# Altium schematic sheet SerialToUSB.SchDoc
size Letter; CompanyName: Penn Electric Racing; Organization: Penn Electric Racing; Address1: 220 S. 33rd St; Address2: Towne Bldg, B11; Address3: Philadelpia, PA 19104; Address4: USA; SheetNumber: 3; SheetTotal: 12
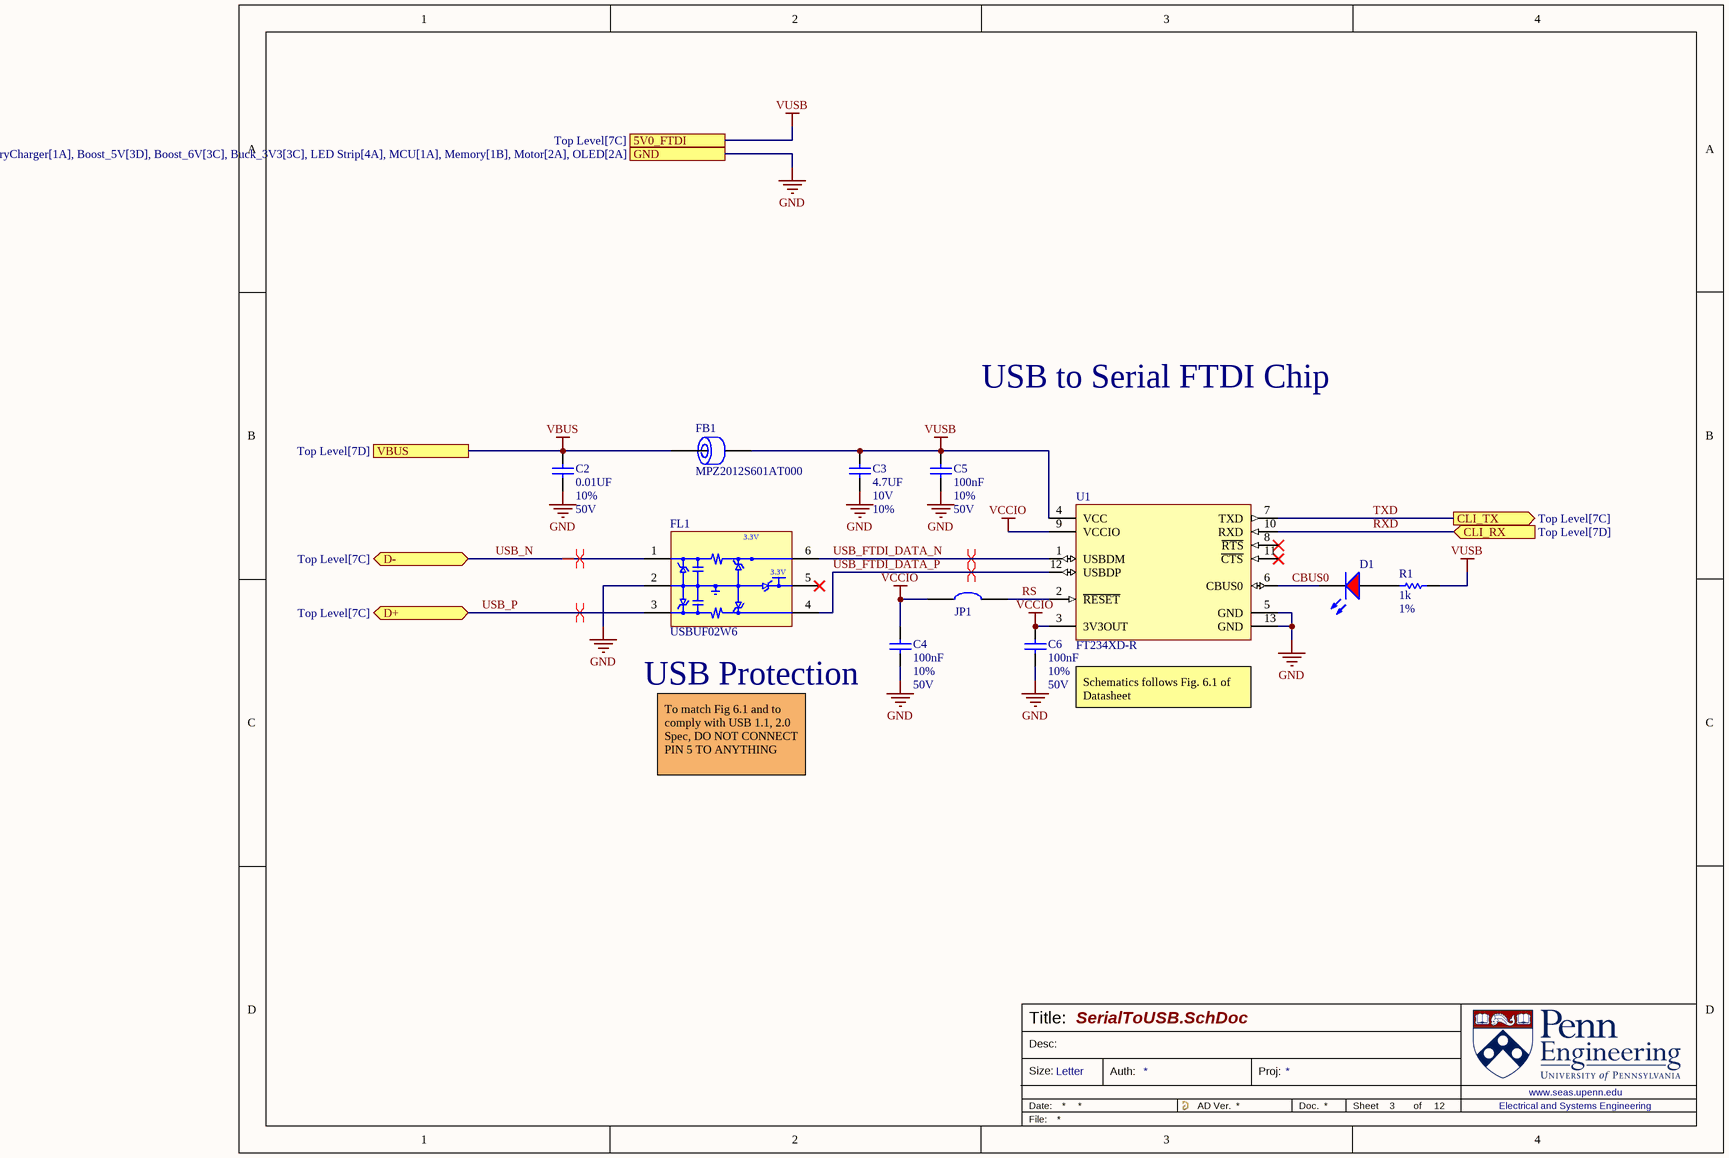
[diagram p0: SerialToUSB.SchDoc]

## Parts
C2  value 0.01UF  Tolerance: 10%  Voltage: 50V  [0603_CAP]  (hidden comment: CAP 0603 0.01UF 50V 10% X7R)
C3  value 4.7UF  Voltage: 10V  Tolerance: 10%  [0805_CAP]  (hidden comment: CAP 0805 4.7UF 10V 10% X7R)
C4  value 100nF  Tolerance: 10%  Voltage: 50V  [0603_CAP]  (hidden comment: CAP 0603 0.1UF 50V 10% X7R)
C5  value 100nF  Tolerance: 10%  Voltage: 50V  [0603_CAP]  (hidden comment: CAP 0603 0.1UF 50V 10% X7R)
C6  value 100nF  Tolerance: 10%  Voltage: 50V  [0603_CAP]  (hidden comment: CAP 0603 0.1UF 50V 10% X7R)
D1  LSM0805412V  [LED_0805_RED]  (value not drawn)
FB1  MPZ2012S601AT000  [FP-MPZ2012-MFG (0805)]
FL1  USBUF02W6  [SOT-363-6-ST]
JP1  0603 link  [0603_JP_RES]  (value not drawn)
R1  value 1k  Tolerance: 1%  [0603_RES]  (hidden comment: RES 0603 1K 1%)
U1  FT234XD-R  [FP-DFN-12-MFG]

## Ports
5V0_FTDI (see Top Level[7C]), CLI_RX (in, see Top Level[7D]), CLI_TX (out, see Top Level[7C]), D+ (bidir, see Top Level[7C]), D- (bidir, see Top Level[7C]), GND (see Top Level[7C], AI_Audio_Module[4A], BatteryCharger[1A], Boost_5V[3D], Boost_6V[3C], Buck_3V3[3C], LED Strip[4A], MCU[1A], Memory[1B], Motor[2A], OLED[2A]), VBUS (see Top Level[7D])

## Nets
GND: C2.1 C3.1 C4.1 C5.1 C6.1 FL1.2(GND) U1.5(GND) U1.13(GND) ; port GND
VBUS: C2.2 FB1.1 ; port VBUS
VCCIO: C4.2 C6.2 JP1.1 U1.3(3V3OUT) U1.9(VCCIO)
VUSB: C3.2 C5.2 FB1.2 R1.2 U1.4(VCC) ; port 5V0_FTDI
CBUS0: D1.K U1.6(CBUS0)
RS: JP1.2 U1.2(~{RESET})
RXD: U1.10(RXD) ; port CLI_RX
TXD: U1.7(TXD) ; port CLI_TX
USB_FTDI_DATA_N: FL1.6(D4) U1.1(USBDM)
USB_FTDI_DATA_P: FL1.4(D3) U1.12(USBDP)
USB_N: FL1.1(D1) ; port D-
USB_P: FL1.3(D2) ; port D+
NetD1_A: D1.A R1.1

Not connected (* = marked no-connect by the designer): FL1 5(3.3_V)*; U1 8(~{RTS})* 11(~{CTS})*

## Layout directives
differential pair; differential pair class USB; net class USB: USB_FTDI_DATA_N, USB_FTDI_DATA_P
differential pair: USB_N, USB_P

## Notes on the sheet
- USB to Serial FTDI Chip
- (near C4) USB Protection
- Schematics follows Fig. 6.1 of Datasheet
- To match Fig 6.1 and to comply with USB 1.1, 2.0 Spec, DO NOT CONNECT PIN 5 TO ANYTHING
- Title:
- Desc:
- Size:
- Letter
- Auth:
- Proj:
- Sheet
- of
- www.seas.upenn.edu
- Electrical and Systems Engineering

## Library data of the parts
C2 = CMP-011-000188-2: Capacitor Surface Mount 0603 Footprint 0.01UF 50V 10% Tolerance Ceramic X7R; Manufacturer: Various; Description in Visual: Cap SMT 0603 0.01UF 50V 10%  Cer X7R; PCB Package: 0603; Mount: SMT; JLCPCB Part #: C57112; Manufacturer P/N: CAP 0603 0.01UF 50V 10% X7R; P/N: CAP 0603 0.01UF 50V 10% X7R; Type: Ceramic X7R
C3 = CMP-011-000522-1: Capacitor Surface Mount 0805 Footprint 4.7UF 10V 10% Tolerance Ceramic X7R; Manufacturer: Various; PCB Package: 0805; Description in Visual: Cap SMT 0805 4.7UF 10V 10%  Cer X7R; P/N: CAP 0805 4.7UF 10V 10% X7R; Type: Ceramic X7R; Manufacturer P/N: CAP 0805 4.7UF 10V 10% X7R; Mount: SMT
C4-C6 = CMP-011-000223-3: Capacitor Surface Mount 0603 Footprint 0.1UF 50V 10% Tolerance Ceramic X7R 100nF; Manufacturer: Various; PCB Package: 0603; Description in Visual: Cap SMT 0603 0.1UF 50V 10%  Cer X7R; JLCPCB Part #: C14663; Mount: SMT; Type: Ceramic X7R; Manufacturer P/N: CAP 0603 0.1UF 50V 10% X7R; P/N: CAP 0603 0.1UF 50V 10% X7R; Capacitor Type: Ceramic; Case/Package: 0603; RoHS: Yes
D1 = CMP-00026-00001-2: Single Color LED, RED, 0805; Test Current: 20mA; Forward Voltage: 2V; Wavelength - Peak: 625nm; RoHS Compliant: Yes; Current: 20mA; Color: Red; Wavelength - Dominant: 625nm
FB1 = CMP-00563-1: 600 Ohms @ 100 MHz 1 Power Line Ferrite Bead 0805 (2012 Metric) 2A 100mOhm
FL1 = CMP-00571-2: Terminator, 2-Line, PDSO6; RC (Pi) EMI Filter 2nd Order Low Pass 2 Channel R = 22Ohms, C = 47pF 6-TSSOP, SC-88, SOT-363, USB 1.1; Nominal Supply Voltage: 3.3V; Interface IC Type: OTHER TERMINATOR; Number of Signal Positions: 2; Differential Output: Yes; Package Equivalence Code: TSSOP6,.08; Qualification Status: Not Qualified; Package Body Material: Plastic; Channels: 1; Width: 1.25mm; Height - Seated (Max): 1.1mm; Surface Mount: Yes; Peak Reflow Temperature (Cel): 260°C; JESD-30 Code: R-PDSO-G6; Length: 2mm; Case/Package: TSSOP; Package Shape: Rectangular; Min Operating Temperature: -40°C; Power Supplies: 3.3V; Temperature Grade: OTHER; Reach SVHC Compliant: Yes; Moisture Sensitivity Level: 1; Pins: 6; Terminal Finish: Tin; RoHS Compliant: Yes; Max Operating Temperature: 70°C; JESD-609 Code: e3; Terminal Position: DUAL; Terminal Form: Gull Wing; Package Style: SMALL OUTLINE, THIN PROFILE, SHRINK PITCHMeter; Terminal Pitch: 0.65mm
JP1 = CMP-00422-5: 0O link, SMD, 0603, Solder Bridge Option; Manufacturer P/N: Various; Manufacturer: Generic; Description in Visual: 0O link, Solder Bridge/SMD, Open; Value: 0.025; Source: Shunts and Jumpers.SchLib; Pin Count: 2; Design Item ID: 0603 link; Component Type: Net Tie; P/N: 0603 link
R1 = CMP-005-002503-3: Resistor Surface Mount, 1K Ohms, 0603 Footprint, 1% Tolerance 0.1W; Manufacturer: Various; PCB Package: 0603; Description in Visual: Res SMT 1K 0603  1%  0.1W; JLCPCB Part #: C21190; Power Rating: 0.1W; Manufacturer P/N: RES 0603 1K 1%; Mount: SMT
U1 = CMP-00104-3: USB Bridge, USB to UART USB 2.0 UART Interface 12-DFN (3x3); Nominal Supply Voltage: 5V; Qualification Status: Not Qualified; Package Body Material: Plastic; Time @ Peak Reflow Temperature-Max (s): 40s; Min Supply Voltage: 2.97V; Max Supply Voltage: 5.5V; Power Supplies: 1.8/3.3,3.3/5V; Package Style: SMALL OUTLINE, HEAT SINK/SLUG, THIN PROFILEMeter; Technology: CMOS; Terminal Pitch: 0.45mm; Terminal Position: DUAL; Moisture Sensitivity Level: 3; Reach SVHC Compliant: Yes; Length: 3mm; Package Shape: Square; Pins: 12; RoHS Compliant: Yes; Temperature Grade: INDUSTRIAL; Min Operating Temperature: -40°C; Peak Reflow Temperature (Cel): 260°C; Surface Mount: Yes; Terminal Form: No Lead; Max Operating Temperature: 85°C; Case/Package: HTSON; Width: 3mm